# Altium project 测速.PrjPCB
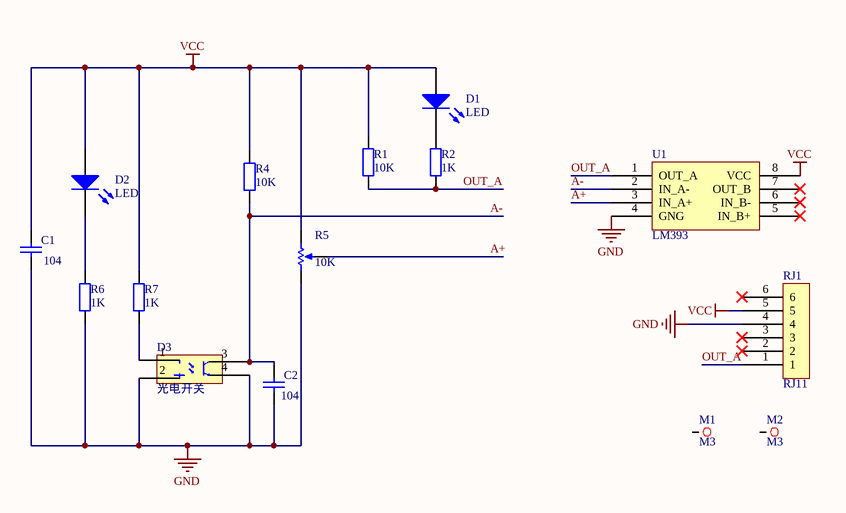
[diagram p0: 测速.SchDoc]
1 sheet, 15 parts. Net scope: global (net labels, ports and power ports of the same name join across sheets).
Board file: 测速.PcbDoc

## Sheet 测速.SchDoc
size A4

### Parts
C1  value 104  [0603_C]  (hidden comment: Cap)
C2  value 104  [0603_C]  (hidden comment: Cap)
D1  LED  [0805]
D2  LED  [0805]
D3  光电开关  [光电开关]
M1  M3  [M3]
M2  M3  [M3]
R1  value 10K  [0603_R]  (hidden comment: Res2)
R2  value 1K  [0603_R]  (hidden comment: Res2)
R4  value 10K  [0603_R]  (hidden comment: Res2)
R5  value 10K  [电位器]  (hidden comment: RPot)
R6  value 1K  [0603_R]  (hidden comment: Res2)
R7  value 1K  [0603_R]  (hidden comment: Res2)
RJ1  RJ11  [RJ11]
U1  LM393  [SO-8]

### Nets
GND: C1.1 C2.1 D3.2 D3.4 R5.1(TOP) R6.1 RJ1.4 U1.4(GNG)
VCC: C1.2 D1.1(A) D2.1(A) R1.2 R4.2 R5.2(BOT) R7.2 RJ1.5 U1.8(VCC)
A+: R5.3(TAP) U1.3(IN_A+)
A-: C2.2 D3.3 R4.1 U1.2(IN_A-)
OUT_A: R1.1 R2.1 RJ1.1 U1.1(OUT_A)
NetD1_2: D1.2(K) R2.2
NetD2_2: D2.2(K) R6.2
NetD3_1: D3.1 R7.1

Not connected (* = marked no-connect by the designer): M1 0; M2 0; RJ1 2* 3* 6*; U1 5(IN_B+)* 6(IN_B-)* 7(OUT_B)*

### Library data of the parts
C1 C2 = Cap: Capacitor; Published: 8-Jun-2000; LatestRevisionDate: 17-Jul-2002; LatestRevisionNote: Re-released for DXP Platform.; PackageReference: RAD-0.3; Publisher: Altium Limited
D1 D2 = LED1: Typical RED GaAs LED; Published: 8-Jun-2000; LatestRevisionDate: 08-Jul-2005; LatestRevisionNote: Mech Layer 1 removed.; PackageReference: LED-1; Publisher: Altium Limited
R1 R2 R4 R6 R7 = Res2: Resistor; Published: 8-Jun-2000; LatestRevisionDate: 17-Jul-2002; LatestRevisionNote: Re-released for DXP Platform.; PackageReference: AXIAL-0.4; Publisher: Altium Limited
R5 = RPot: Potentiometer; Sim Note: Enter the Resistance value and the set point into parameter fields.; Set Position: 0.5; Published: 8-Jun-2000; LatestRevisionDate: 17-Jul-2002; LatestRevisionNote: Re-released for DXP Platform.; PackageReference: VR5; Publisher: Altium Limited